# Altium schematic sheet BlockDiagram.SchDoc: <title>
size A4; Organization: Institut d'Automatisation Industrielle; SheetNumber: 2; SheetTotal: 8; SVN: OUI; CurrentTime: 6; CurrentDate: 5; DocumentFullPathAndName: 8; DocumentName: 9; ModifiedDate: 13; ProjectName: <projet>
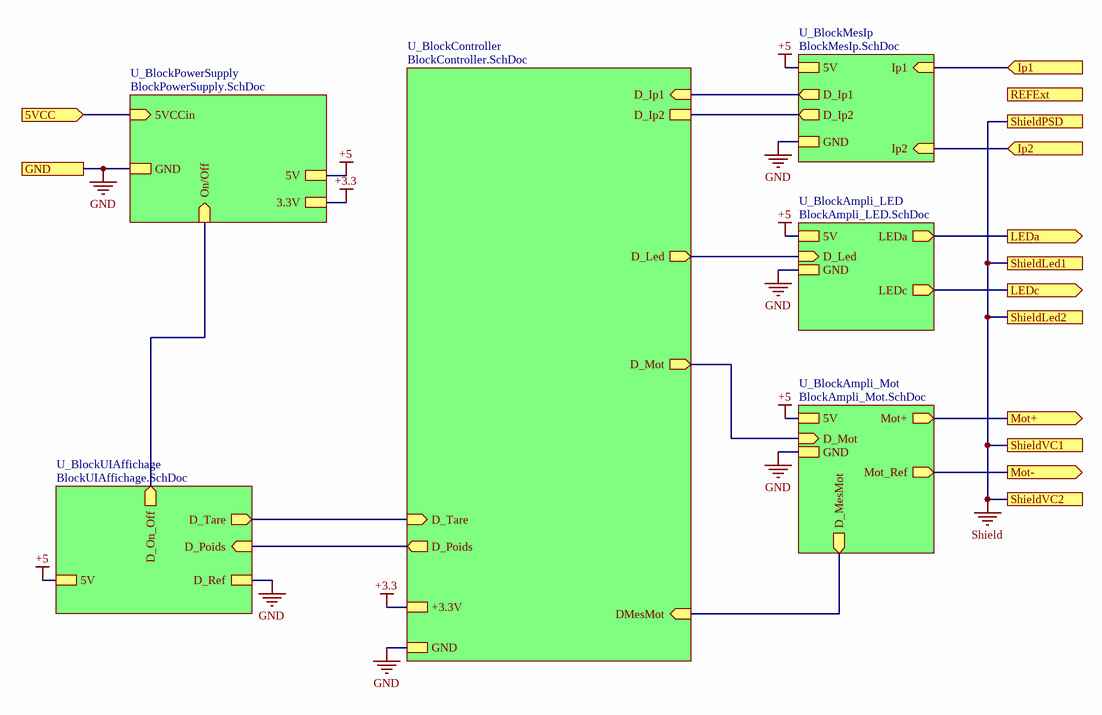
[diagram p0: BlockDiagram.SchDoc]

## Sub-sheets
U_BlockAmpli_LED = BlockAmpli_LED.SchDoc: LEDa (out), LEDc (out), D_Led (in), GND, 5V
U_BlockAmpli_Mot = BlockAmpli_Mot.SchDoc: Mot+ (out), Mot_Ref (out), D_Mot (in), GND, 5V, D_MesMot (out)
U_BlockController = BlockController.SchDoc: D_Ip1 (in), D_Ip2, D_Led (out), D_Mot (out), DMesMot (in), D_Tare (in), GND, +3.3V, D_Poids (out)
U_BlockMesIp = BlockMesIp.SchDoc: Ip1 (in), Ip2 (in), D_Ip1 (out), D_Ip2 (out), GND, 5V
U_BlockPowerSupply = BlockPowerSupply.SchDoc: 5V, GND, 5VCCin (in), On/Off (in), 3.3V
U_BlockUIAffichage = BlockUIAffichage.SchDoc: D_Ref, D_Tare (out), D_On_Off (out), 5V, D_Poids (in)

## Ports
5VCC (in), GND, Ip1 (in), Ip2 (in), LEDa (out), LEDc (out), Mot+ (out), Mot- (out), REFExt (out), ShieldLed1, ShieldLed2, ShieldPSD, ShieldVC1, ShieldVC2

## Nets
+3.3: sheet U_BlockPowerSupply/3.3V, sheet U_BlockController/+3.3V
+5: sheet U_BlockPowerSupply/5V, sheet U_BlockAmpli_LED/5V, sheet U_BlockAmpli_Mot/5V, sheet U_BlockMesIp/5V, sheet U_BlockUIAffichage/5V
GND: port GND, sheet U_BlockPowerSupply/GND, sheet U_BlockAmpli_LED/GND, sheet U_BlockAmpli_Mot/GND, sheet U_BlockMesIp/GND, sheet U_BlockUIAffichage/D_Ref, sheet U_BlockController/GND
Shield: port ShieldPSD, port ShieldLed1, port ShieldLed2, port ShieldVC1, port ShieldVC2
5VCC: port 5VCC, sheet U_BlockPowerSupply/5VCCin
Ip1: port Ip1, sheet U_BlockMesIp/Ip1
Ip2: port Ip2, sheet U_BlockMesIp/Ip2
LEDa: port LEDa, sheet U_BlockAmpli_LED/LEDa
LEDc: port LEDc, sheet U_BlockAmpli_LED/LEDc
Mot+: port Mot+, sheet U_BlockAmpli_Mot/Mot+
Mot-: port Mot-, sheet U_BlockAmpli_Mot/Mot_Ref
(unnamed): sheet U_BlockPowerSupply/On/Off, sheet U_BlockUIAffichage/D_On_Off
(unnamed): sheet U_BlockAmpli_LED/D_Led, sheet U_BlockController/D_Led
(unnamed): sheet U_BlockAmpli_Mot/D_Mot, sheet U_BlockController/D_Mot
(unnamed): sheet U_BlockAmpli_Mot/D_MesMot, sheet U_BlockController/DMesMot
(unnamed): sheet U_BlockMesIp/D_Ip1, sheet U_BlockController/D_Ip1
(unnamed): sheet U_BlockMesIp/D_Ip2, sheet U_BlockController/D_Ip2
(unnamed): sheet U_BlockUIAffichage/D_Tare, sheet U_BlockController/D_Tare
(unnamed): sheet U_BlockUIAffichage/D_Poids, sheet U_BlockController/D_Poids

## Notes on the sheet
- Title
- Institut d'automatisation industrielle
  rte de Cheseaux 1
  CH-1401 Yverdon-les-Bains
  T +41(0)24 55 77 377    F +41(0)24 55 76 320
  http://iai.heig-vd.ch       iai@heig-vd.ch
- Date:
- Size:
- A4
- Project:
- Sheet
- of
- No.
- Author:
- SVN
- Version
- File: